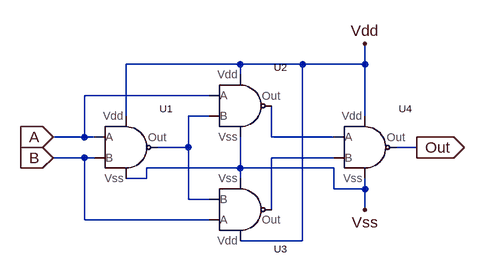
[diagram p0: schematic XOR1.asc]
XOR1.asc, the LTspice schematic file:
Version 4
SHEET 1 880 680
WIRE 352 0 176 0
WIRE 448 0 352 0
WIRE 544 0 544 -32
WIRE 544 0 448 0
WIRE 352 16 352 0
WIRE 304 48 112 48
WIRE 176 80 176 0
WIRE 304 80 272 80
WIRE 544 80 544 0
WIRE 112 112 112 48
WIRE 112 112 64 112
WIRE 128 112 112 112
WIRE 400 112 400 64
WIRE 496 112 400 112
WIRE 272 128 272 80
WIRE 272 128 224 128
WIRE 624 128 592 128
WIRE 112 144 64 144
WIRE 128 144 112 144
WIRE 496 144 400 144
WIRE 352 160 352 112
WIRE 352 160 208 160
WIRE 496 160 352 160
WIRE 208 176 208 160
WIRE 208 176 176 176
WIRE 352 176 352 160
WIRE 496 192 496 160
WIRE 544 192 544 176
WIRE 544 192 496 192
WIRE 272 208 272 128
WIRE 304 208 272 208
WIRE 400 224 400 144
WIRE 544 224 544 192
WIRE 112 240 112 144
WIRE 304 240 112 240
WIRE 448 272 448 0
WIRE 448 272 352 272
FLAG 64 112 A
IOPIN 64 112 In
FLAG 64 144 B
IOPIN 64 144 In
FLAG 624 128 Out
IOPIN 624 128 Out
FLAG 544 -32 Vdd
FLAG 544 224 Vss
SYMBOL NAND1 144 128 R0
SYMATTR InstName U1
SYMBOL NAND1 320 64 R0
SYMATTR InstName U2
SYMBOL NAND1 320 224 M180
SYMATTR InstName U3
SYMBOL NAND1 512 128 R0
SYMATTR InstName U4

The netlist it stands for:
* XOR1.asc
XU1 A B N001 Vss Vdd NAND1  ; pins A B Out Vss Vdd
XU2 A N001 N002 Vss Vdd NAND1  ; pins A B Out Vss Vdd
XU3 B N001 N003 Vss Vdd NAND1  ; pins A B Out Vss Vdd
XU4 N002 N003 Out Vss Vdd NAND1  ; pins A B Out Vss Vdd
.lib NAND1.sub
.backanno
.end